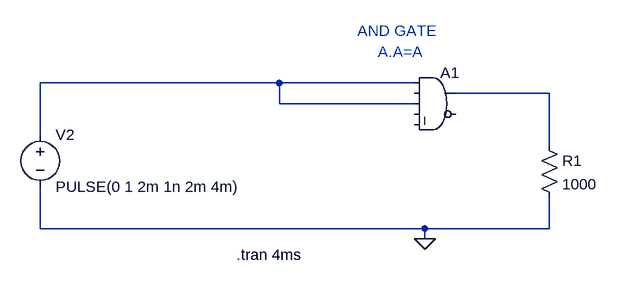
[diagram p0: schematic 4_A_dot_A_equal_A.asc]
4_A_dot_A_equal_A.asc, the LTspice schematic file:
Version 4
SHEET 1 880 680
WIRE 192 96 -176 96
WIRE 400 96 192 96
WIRE 608 112 464 112
WIRE 192 128 192 96
WIRE 400 128 192 128
WIRE -176 176 -176 96
WIRE 608 192 608 112
WIRE -176 320 -176 256
WIRE 416 320 -176 320
WIRE 608 320 608 272
WIRE 608 320 416 320
WIRE 416 336 416 320
FLAG 416 336 0
SYMBOL voltage -176 160 R0
WINDOW 123 0 0 Left 0
WINDOW 39 0 0 Left 0
SYMATTR InstName V2
SYMATTR Value PULSE(0 1 2m 1n 2m 4m)
SYMBOL res 592 176 R0
SYMATTR InstName R1
SYMATTR Value 1000
SYMBOL Digital\\and 432 64 R0
SYMATTR InstName A1
TEXT 312 16 Left 2 ;AND GATE
TEXT 126 360 Left 2 !.tran 4ms
TEXT 344 48 Left 2 ;A.A=A

The netlist it stands for:
* 4_A_dot_A_equal_A.asc
V2 N001 0 PULSE(0 1 2m 1n 2m 4m)
R1 N002 0 1000
A1 N001 0 N001 0 0 0 N002 0 AND
* AND GATE
.tran 4ms
* A.A=A
.backanno
.end